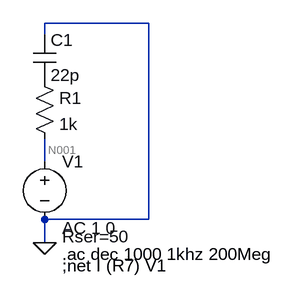
[diagram p0: schematic Draft1.asc]
Draft1.asc, the LTspice schematic file:
Version 4
SHEET 1 880 680
WIRE 32 -112 -112 -112
WIRE -112 -96 -112 -112
WIRE -112 80 -112 48
WIRE 32 160 32 -112
WIRE 32 160 -112 160
WIRE -112 192 -112 160
FLAG -112 192 0
SYMBOL voltage -112 64 R0
WINDOW 123 24 108 Left 2
WINDOW 39 24 120 Left 2
SYMATTR Value2 AC 1 0
SYMATTR SpiceLine Rser=50
SYMATTR InstName V1
SYMATTR Value ""
SYMBOL res -128 -48 R0
SYMATTR InstName R1
SYMATTR Value 1k
SYMBOL cap -128 -96 R0
SYMATTR InstName C1
SYMATTR Value 22p
TEXT -88 208 Left 2 !.ac dec 1000 1khz 200Meg
TEXT -88 224 Left 2 !;net I (R7) V1

The netlist it stands for:
* Draft1.asc
V1 N001 0 AC 1 0 Rser=50
R1 P001 N001 1k
C1 0 P001 22p
.ac dec 1000 1khz 200Meg
;net I (R7) V1
.backanno
.end

* Results of the author's LTspice run, read from the files saved beside the schematic
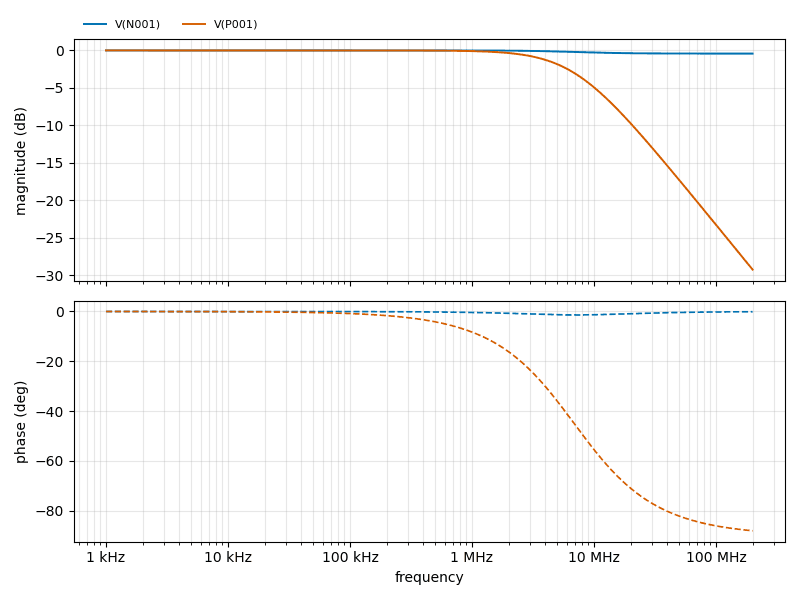
[diagram p1: AC Analysis of Draft1.asc, plotted from the saved traces]
* AC Analysis, 1 run:
*   V(N001): -0.00 dB at 1 kHz, -0.42 dB at 200 MHz, peak -0.00 dB at 1 kHz
*   V(P001): -0.00 dB at 1 kHz, -29.26 dB at 200 MHz, peak -0.00 dB at 1 kHz, 3 dB below the peak at 6.89 MHz